# Altium schematic sheet APD9328_FPGA_BANK.SchDoc: FPGA BANK
size A4; Author: NC; Revision: 1.0; SheetNumber: 13; SheetTotal: 14
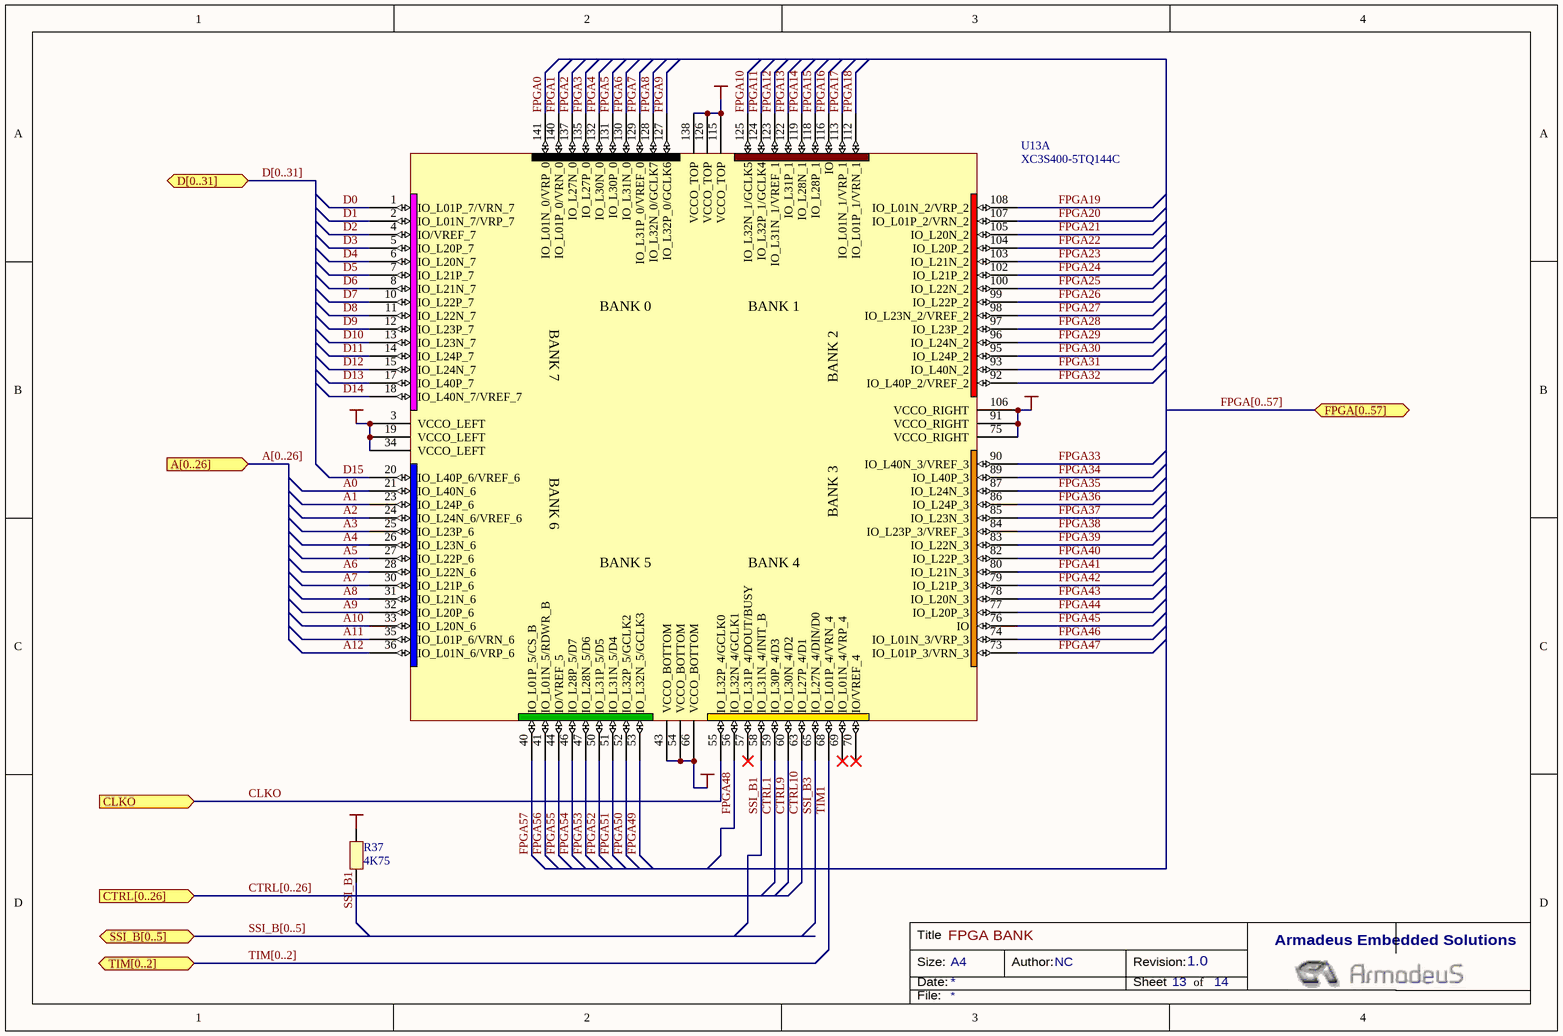
[diagram p0: APD9328_FPGA_BANK.SchDoc]

## Parts
R37  4K75  [0402]
U13  XC3S400-5TQ144C  [TQ144]  (part A of 2)

## Ports
A[0..26] (in), CLKO (in), CTRL[0..26] (in), D[0..31] (bidir), FPGA[0..57] (bidir), SSI_B[0..5] (bidir), TIM[0..2] (bidir)

## Nets
+3V3: R37.2 U13.3(VCCO_LEFT) U13.19(VCCO_LEFT) U13.34(VCCO_LEFT) U13.43(VCCO_BOTTOM) U13.54(VCCO_BOTTOM) U13.66(VCCO_BOTTOM) U13.75(VCCO_RIGHT) U13.91(VCCO_RIGHT) U13.106(VCCO_RIGHT) U13.115(VCCO_TOP) U13.126(VCCO_TOP) U13.138(VCCO_TOP)
A0: U13.21(IO_L40N_6)
A1: U13.23(IO_L24P_6)
A2: U13.24(IO_L24N_6/VREF_6)
A3: U13.25(IO_L23P_6)
A4: U13.26(IO_L23N_6)
A5: U13.27(IO_L22P_6)
A6: U13.28(IO_L22N_6)
A7: U13.30(IO_L21P_6)
A8: U13.31(IO_L21N_6)
A9: U13.32(IO_L20P_6)
A10: U13.33(IO_L20N_6)
A11: U13.35(IO_L01P_6/VRN_6)
A12: U13.36(IO_L01N_6/VRP_6)
CLKO: U13.55(IO_L32P_4/GCLK0) ; port CLKO
CTRL1: U13.59(IO_L30P_4/D3)
CTRL9: U13.60(IO_L30N_4/D2)
CTRL10: U13.63(IO_L27P_4/D1)
D0: U13.1(IO_L01P_7/VRN_7)
D1: U13.2(IO_L01N_7/VRP_7)
D2: U13.4(IO/VREF_7)
D3: U13.5(IO_L20P_7)
D4: U13.6(IO_L20N_7)
D5: U13.7(IO_L21P_7)
D6: U13.8(IO_L21N_7)
D7: U13.10(IO_L22P_7)
D8: U13.11(IO_L22N_7)
D9: U13.12(IO_L23P_7)
D10: U13.13(IO_L23N_7)
D11: U13.14(IO_L24P_7)
D12: U13.15(IO_L24N_7)
D13: U13.17(IO_L40P_7)
D14: U13.18(IO_L40N_7/VREF_7)
D15: U13.20(IO_L40P_6/VREF_6)
FPGA0: U13.141(IO_L01N_0/VRP_0)
FPGA1: U13.140(IO_L01P_0/VRN_0)
FPGA2: U13.137(IO_L27N_0)
FPGA3: U13.135(IO_L27P_0)
FPGA4: U13.132(IO_L30N_0)
FPGA5: U13.131(IO_L30P_0)
FPGA6: U13.130(IO_L31N_0)
FPGA7: U13.129(IO_L31P_0/VREF_0)
FPGA8: U13.128(IO_L32N_0/GCLK7)
FPGA9: U13.127(IO_L32P_0/GCLK6)
FPGA10: U13.125(IO_L32N_1/GCLK5)
FPGA11: U13.124(IO_L32P_1/GCLK4)
FPGA12: U13.123(IO_L31N_1/VREF_1)
FPGA13: U13.122(IO_L31P_1)
FPGA14: U13.119(IO_L28N_1)
FPGA15: U13.118(IO_L28P_1)
FPGA16: U13.116(IO)
FPGA17: U13.113(IO_L01N_1/VRP_1)
FPGA18: U13.112(IO_L01P_1/VRN_1)
FPGA19: U13.108(IO_L01N_2/VRP_2)
FPGA20: U13.107(IO_L01P_2/VRN_2)
FPGA21: U13.105(IO_L20N_2)
FPGA22: U13.104(IO_L20P_2)
FPGA23: U13.103(IO_L21N_2)
FPGA24: U13.102(IO_L21P_2)
FPGA25: U13.100(IO_L22N_2)
FPGA26: U13.99(IO_L22P_2)
FPGA27: U13.98(IO_L23N_2/VREF_2)
FPGA28: U13.97(IO_L23P_2)
FPGA29: U13.96(IO_L24N_2)
FPGA30: U13.95(IO_L24P_2)
FPGA31: U13.93(IO_L40N_2)
FPGA32: U13.92(IO_L40P_2/VREF_2)
FPGA33: U13.90(IO_L40N_3/VREF_3)
FPGA34: U13.89(IO_L40P_3)
FPGA35: U13.87(IO_L24N_3)
FPGA36: U13.86(IO_L24P_3)
FPGA37: U13.85(IO_L23N_3)
FPGA38: U13.84(IO_L23P_3/VREF_3)
FPGA39: U13.83(IO_L22N_3)
FPGA40: U13.82(IO_L22P_3)
FPGA41: U13.80(IO_L21N_3)
FPGA42: U13.79(IO_L21P_3)
FPGA43: U13.78(IO_L20N_3)
FPGA44: U13.77(IO_L20P_3)
FPGA45: U13.76(IO)
FPGA46: U13.74(IO_L01N_3/VRP_3)
FPGA47: U13.73(IO_L01P_3/VRN_3)
FPGA48: U13.56(IO_L32N_4/GCLK1)
FPGA49: U13.53(IO_L32N_5/GCLK3)
FPGA50: U13.52(IO_L32P_5/GCLK2)
FPGA51: U13.51(IO_L31N_5/D4)
FPGA52: U13.50(IO_L31P_5/D5)
FPGA53: U13.47(IO_L28N_5/D6)
FPGA54: U13.46(IO_L28P_5/D7)
FPGA55: U13.44(IO/VREF_5)
FPGA56: U13.41(IO_L01N_5/RDWR_B)
FPGA57: U13.40(IO_L01P_5/CS_B)
SSI_B1: R37.1 U13.58(IO_L31N_4/INIT_B)
SSI_B3: U13.65(IO_L27N_4/DIN/D0)
TIM1: U13.68(IO_L01P_4/VRN_4)

Not connected (* = marked no-connect by the designer): U13 57(IO_L31P_4/DOUT/BUSY)* 69(IO_L01N_4/VRP_4)* 70(IO/VREF_4)*

## Buses and harness runs
bus A[0..26] = port A[0..26]
bus CTRL[0..26] = port CTRL[0..26]
bus D[0..31] = port D[0..31]
bus FPGA[0..57] = port FPGA[0..57]
bus SSI_B[0..5] = port SSI_B[0..5]
bus TIM[0..2] = port TIM[0..2]

## Notes on the sheet
- Title
- Size:
- Date:
- A4
- Author:
- Revision:
- Sheet
- of
- Armadeus Embedded Solutions
- File:
- (in symbol XC3S400-5TQ144C, part A) BANK 0; BANK 1; BANK 7; BANK 2; BANK 6; BANK 3; BANK 5; BANK 4

## Library data of the parts
R37 = Res: Assembly Option: X
U13 = XC3S400-5TQ144C: Spartan-3 1.2V FPGA, 97 User I/Os, 144-pin TQFP, High Performance, Commercial Grade; Manufacturer: Xilinx; Part Number: XC3S400-4TQ144C; Part Number (X200): XC3S200-4TQ144C; Part Number (X50): XC3S50-4TQ144C; PackageDocument: ver1.1, Oct-2002; Assembly Option: X400; Published: 17-Sep-2003; DatasheetDocument: 04-Mar-2004; PackageReference: TQ144; Publisher: Altium Limited; Code_JEDEC: MS-026-BFB; Code_IPC: SQFP20X20-144; Distributor: Avnet; Price_100: 18,26; Price_500: 14; Price_1000: 12; Price_100 (X200): 12,54; Price_500 (X200): 9; Price_1000 (X200): 8; Price_100 (X50): 10,23; Price_100 (X50): 7; Price_1000 (X50): 6